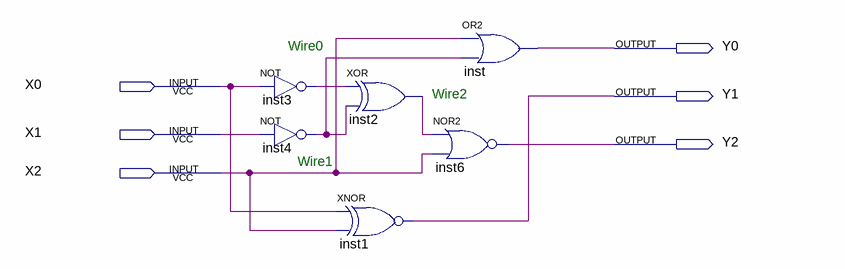
[diagram p0: schematic sheet]
// Quartus schematic Lab1.bdf as structural Verilog: 6 symbols, 6 pins
module Lab1 (
  input  X0,
  input  X1,
  input  X2,
  output Y0,
  output Y1,
  output Y2
);

  wire inst2_out, inst3_out, inst4_out;

  not inst3 (inst3_out, X0);
  not inst4 (inst4_out, X1);
  xor inst2 (inst2_out, inst3_out, inst4_out);
  xnor inst1 (Y1, X0, X2);
  or inst (Y0, X2, inst4_out);
  nor inst6 (Y2, inst2_out, X2);

  // Notes on the sheet:
  //   Wire0
  //   Wire2
  //   Wire1
endmodule
